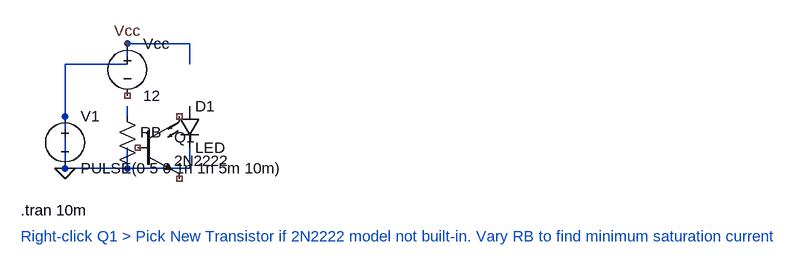
[diagram p0: schematic 09_BJT_switch_LED.asc]
09_BJT_switch_LED.asc, the LTspice schematic file:
Version 4
SHEET 1 880 680
WIRE 320 96 320 64
WIRE 320 64 224 64
WIRE 224 64 224 96
WIRE 320 176 320 160
WIRE 224 176 224 160
WIRE 224 256 224 224
WIRE 320 256 320 224
WIRE 320 256 224 256
WIRE 128 176 128 96
WIRE 128 96 224 96
WIRE 128 256 128 176
WIRE 128 256 224 256
FLAG 128 256 0
FLAG 224 64 Vcc
SYMBOL voltage 128 160 R0
SYMATTR InstName V1
SYMATTR Value PULSE(0 5 0 1n 1n 5m 10m)
SYMBOL voltage 224 48 R0
SYMATTR InstName Vcc
SYMATTR Value 12
SYMBOL res 208 160 R0
WINDOW 3 -60 40 Invisible 2
SYMATTR InstName RB
SYMATTR Value 1k
SYMBOL LED 304 160 R0
SYMATTR InstName D1
SYMATTR Value LED
SYMBOL npn 240 176 R0
SYMATTR InstName Q1
SYMATTR Value 2N2222
TEXT 60 320 Left 2 !.tran 10m
TEXT 60 360 Left 2 ;Right-click Q1 > Pick New Transistor if 2N2222 model not built-in. Vary RB to find minimum saturation current

The netlist it stands for:
* 09_BJT_switch_LED.asc
V1 0 0 PULSE(0 5 0 1n 1n 5m 10m)
Vcc 0 NC_01 12
RB N002 0 1k
D1 N001 0 LED
Q1 NC_02 NC_03 NC_04 0 2N2222
.model D D
.lib standard.dio
.model NPN NPN
.model PNP PNP
.lib standard.bjt
.tran 10m
* Right-click Q1 > Pick New Transistor if 2N2222 model not built-in. Vary RB to find minimum saturation current
.backanno
.end